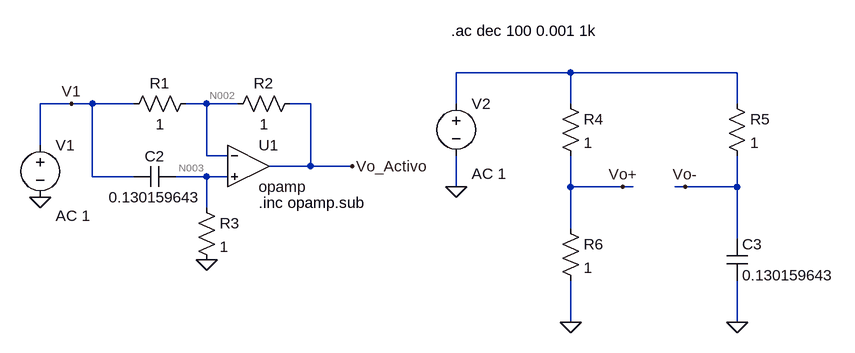
[diagram p0: schematic Ej1.asc]
Ej1.asc, the LTspice schematic file:
Version 4
SHEET 1 1248 680
WIRE 688 32 512 32
WIRE 944 32 688 32
WIRE -80 80 -128 80
WIRE -48 80 -80 80
WIRE 16 80 -48 80
WIRE 128 80 96 80
WIRE 176 80 128 80
WIRE 288 80 256 80
WIRE 512 80 512 32
WIRE 688 80 688 32
WIRE 944 80 944 32
WIRE -128 144 -128 80
WIRE 128 160 128 80
WIRE 160 160 128 160
WIRE 288 176 288 80
WIRE 288 176 224 176
WIRE 352 176 288 176
WIRE -48 192 -48 80
WIRE 16 192 -48 192
WIRE 128 192 80 192
WIRE 160 192 128 192
WIRE 512 208 512 160
WIRE 688 208 688 160
WIRE 768 208 688 208
WIRE 784 208 768 208
WIRE 864 208 848 208
WIRE 944 208 944 160
WIRE 944 208 864 208
WIRE 128 240 128 192
WIRE 688 272 688 208
WIRE 944 288 944 208
WIRE 688 416 688 352
WIRE 944 416 944 352
FLAG 128 320 0
FLAG 352 176 Vo_Activo
FLAG -80 80 V1
FLAG -128 224 0
FLAG 512 208 0
FLAG 688 416 0
FLAG 944 416 0
FLAG 768 208 Vo+
FLAG 864 208 Vo-
SYMBOL OpAmps\\opamp 192 112 R0
SYMATTR InstName U1
SYMATTR SpiceLine Aol=10000meg
SYMATTR SpiceLine2 GBW=100000Meg
SYMBOL res 112 64 R90
WINDOW 0 0 56 VBottom 2
WINDOW 3 32 56 VTop 2
SYMATTR InstName R1
SYMATTR Value 1
SYMBOL res 272 64 R90
WINDOW 0 0 56 VBottom 2
WINDOW 3 32 56 VTop 2
SYMATTR InstName R2
SYMATTR Value 1
SYMBOL cap 80 176 R90
WINDOW 0 0 32 VBottom 2
WINDOW 3 32 32 VTop 2
SYMATTR InstName C2
SYMATTR Value 0.130159643
SYMBOL res 112 224 R0
SYMATTR InstName R3
SYMATTR Value 1
SYMBOL voltage -128 128 R0
WINDOW 123 24 124 Left 2
WINDOW 39 0 0 Left 0
SYMATTR Value2 AC 1
SYMATTR InstName V1
SYMATTR Value ""
SYMBOL voltage 512 64 R0
WINDOW 123 24 124 Left 2
WINDOW 39 0 0 Left 0
SYMATTR Value2 AC 1
SYMATTR InstName V2
SYMATTR Value ""
SYMBOL res 672 64 R0
SYMATTR InstName R4
SYMATTR Value 1
SYMBOL cap 928 288 R0
SYMATTR InstName C3
SYMATTR Value 0.130159643
SYMBOL res 928 64 R0
SYMATTR InstName R5
SYMATTR Value 1
SYMBOL res 672 256 R0
SYMATTR InstName R6
SYMATTR Value 1
TEXT 208 232 Left 2 !.inc opamp.sub
TEXT 504 -32 Left 2 !.ac dec 100 0.001 1k

The netlist it stands for:
* Ej1.asc
XU1 N002 N003 Vo_Activo opamp Aol=10000meg GBW=100000Meg  ; pins invin noninvin out
R1 N002 V1 1
R2 Vo_Activo N002 1
C2 N003 V1 0.130159643
R3 N003 0 1
V1 V1 0 AC 1
V2 N001 0 AC 1
R4 N001 Vo+ 1
C3 Vo- 0 0.130159643
R5 N001 Vo- 1
R6 Vo+ 0 1
.inc opamp.sub
.ac dec 100 0.001 1k
.backanno
.end

* Results of the author's LTspice run, read from the files saved beside the schematic
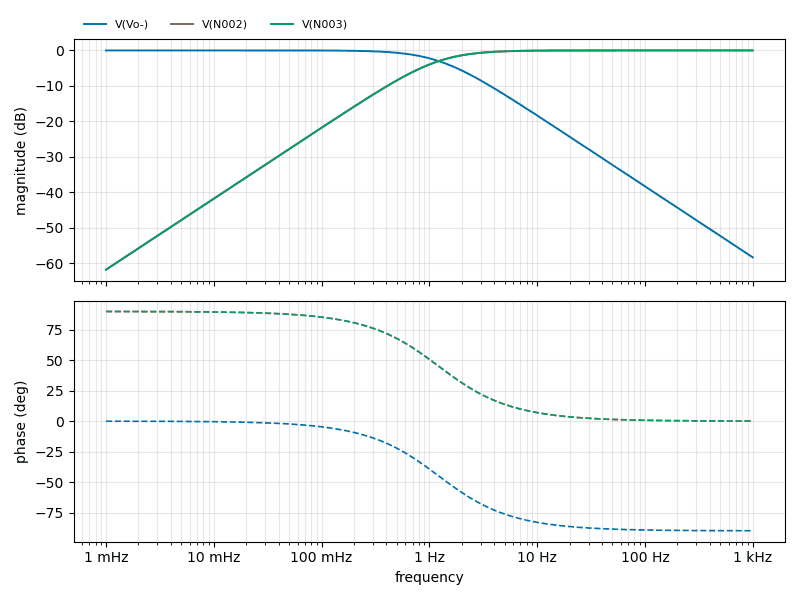
[diagram p1: AC Analysis of Ej1.asc, plotted from the saved traces]
* AC Analysis, 1 run:
*   V(Vo-): -0.00 dB at 1 mHz, -58.25 dB at 1 kHz, peak -0.00 dB at 1 mHz, 3 dB below the peak at 1.223 Hz
*   V(N002): -61.75 dB at 1 mHz, -0.00 dB at 1 kHz, peak -0.00 dB at 1 kHz, 3 dB below the peak at 1.223 Hz
*   V(N003): -61.75 dB at 1 mHz, -0.00 dB at 1 kHz, peak -0.00 dB at 1 kHz, 3 dB below the peak at 1.223 Hz